# EasyEDA schematic gcgc2.json
TITLE: Sheet_1; REV: 1.0; Date: 2021-07-03; Sheet: 1/1; Company: Your Company
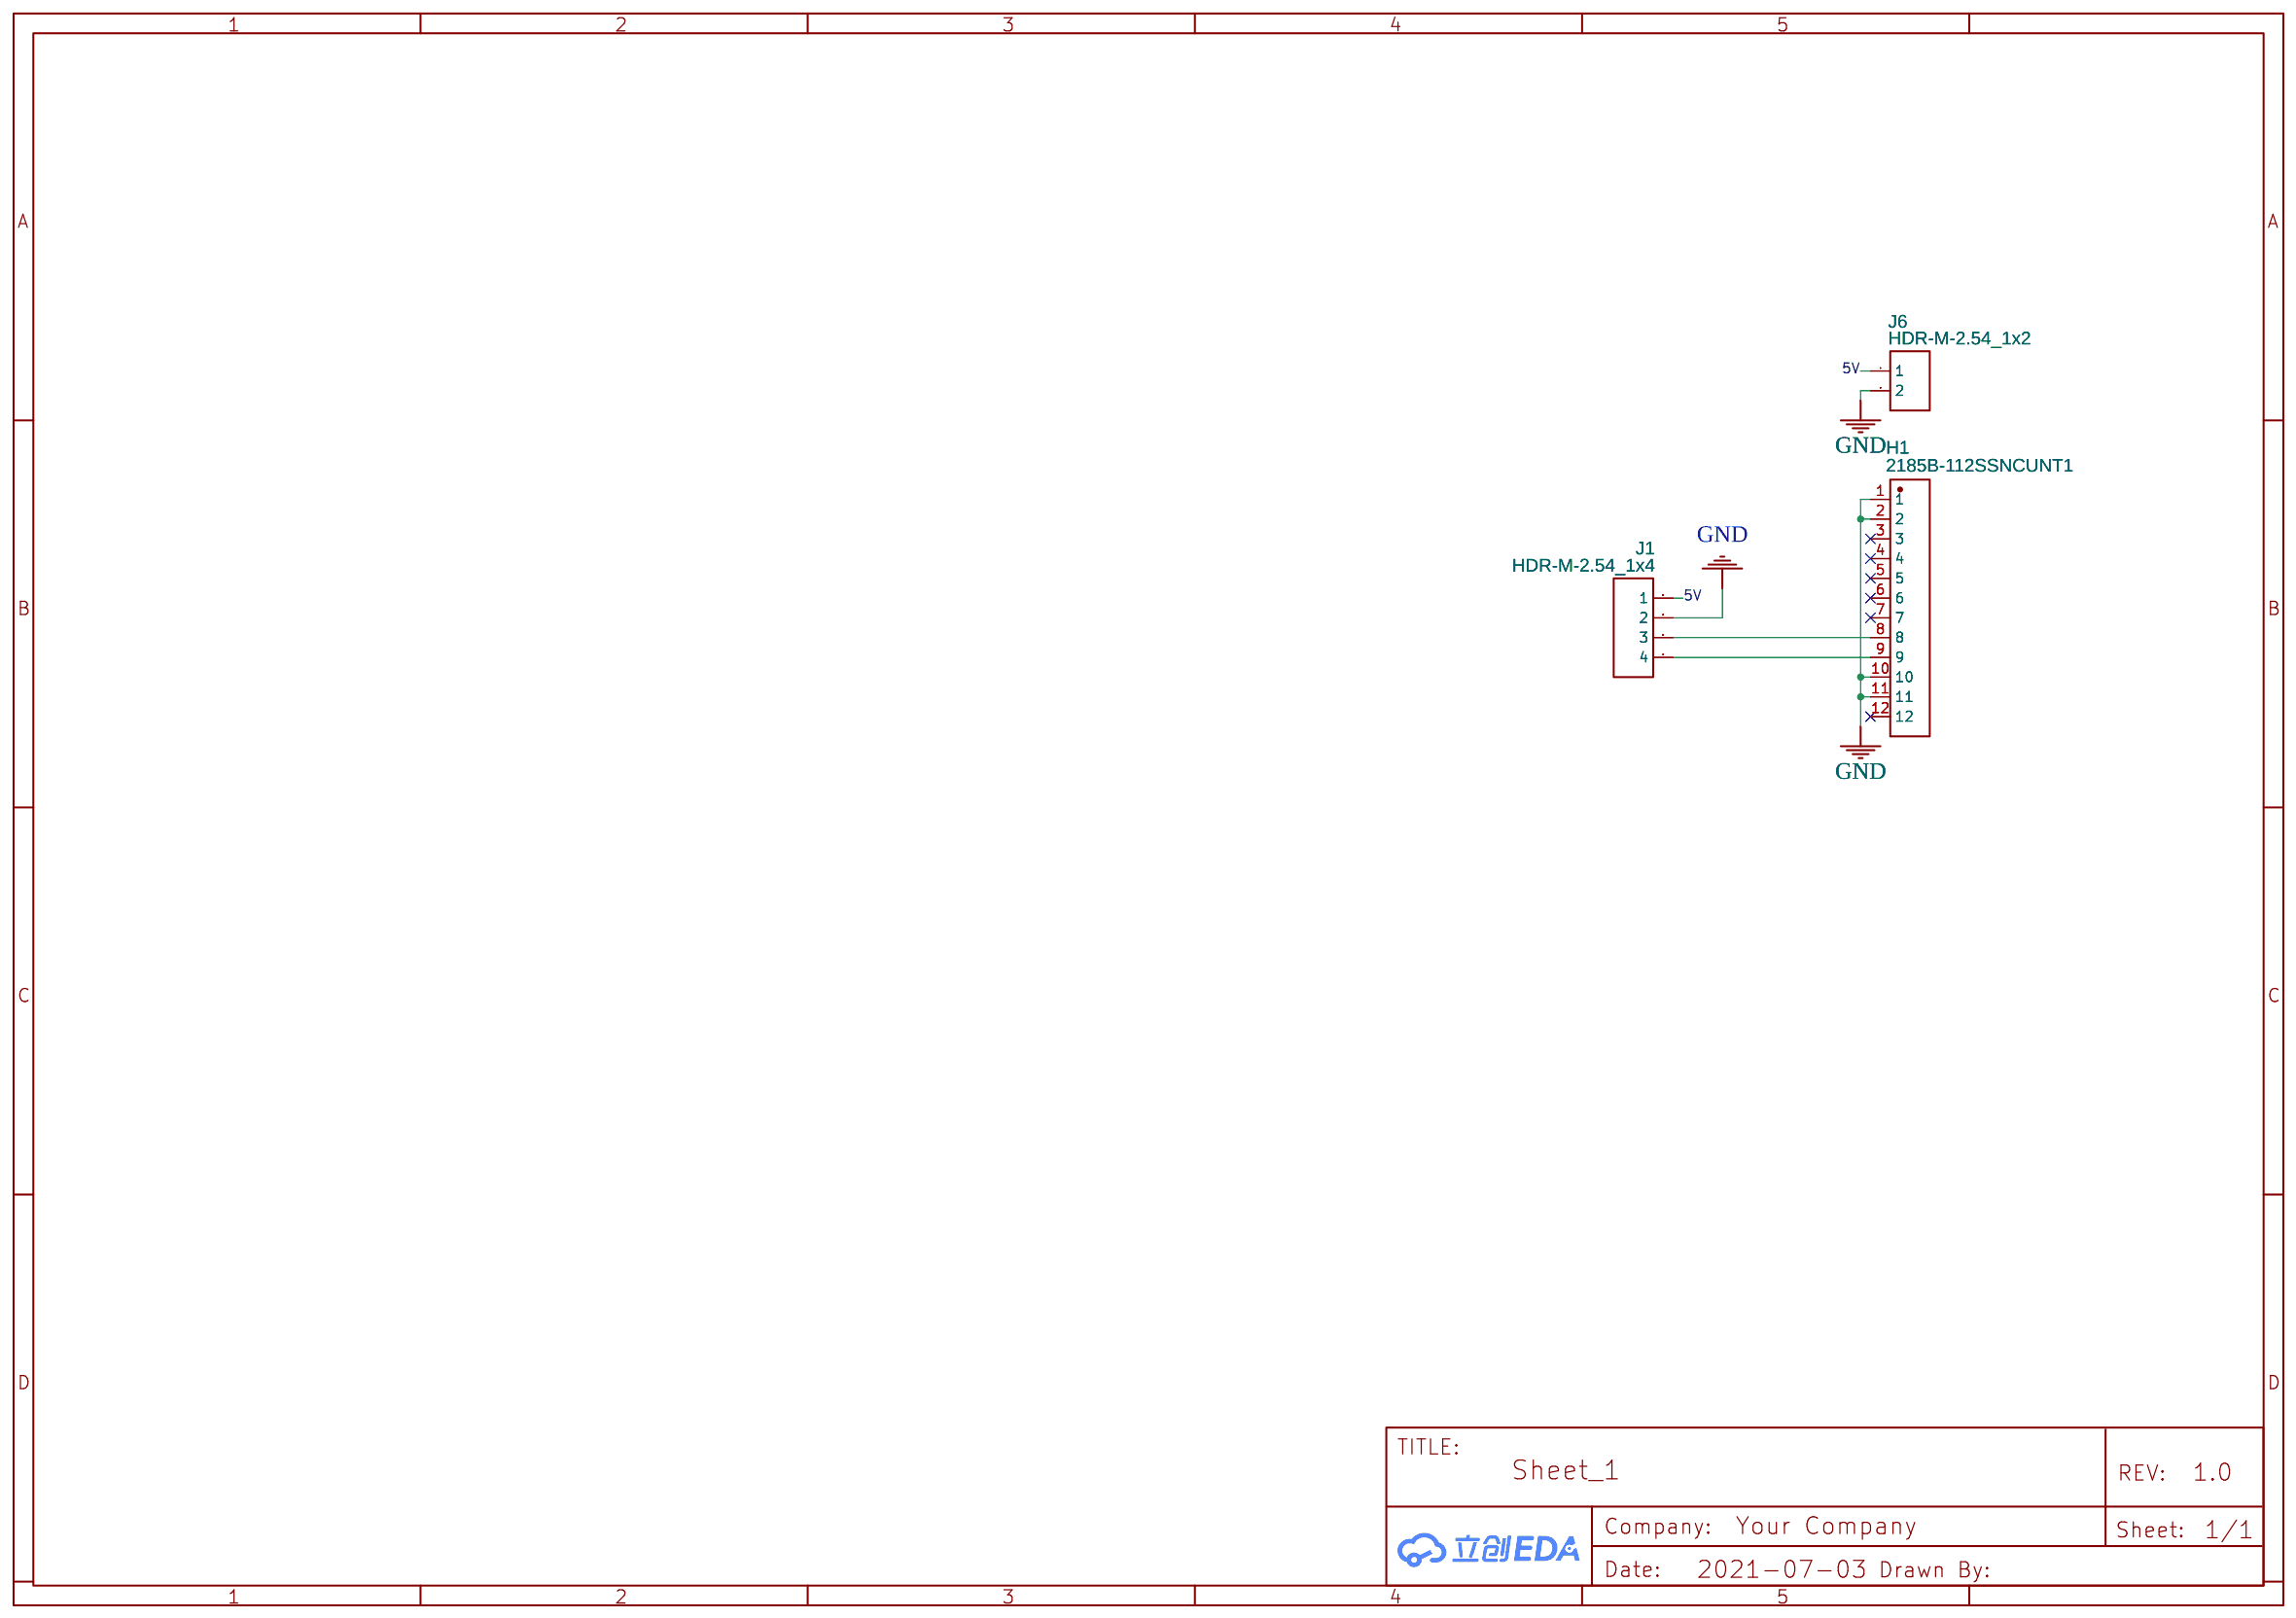
[diagram p0: schematic sheet]

## Parts
H1  2185B-112SSNCUNT1  [HDR-TH_12P-P2.54-V-F]
J1  HDR-M-2.54_1x4  [HDR-M-2.54_1X4]
J6  HDR-M-2.54_1x2  [HDR-M-2.54_1X2]

## Library data of the parts
H1 = 2185B-112SSNCUNT1: Supplier: LCSC; Supplier Part: C721800; Manufacturer: Wcon; Contributor: LCSC; JLCPCB Part Class: Extended Part
J1 = HDR-M-2.54_1x4: Supplier Part: C124378; Supplier: LCSC; Contributor: LCEDA_Lib
J6 = HDR-M-2.54_1x2: Supplier Part: C124375; Supplier: LCSC; Contributor: LCEDA_Lib

## Nets
5V: J1.1 J6.1
GND: H1.1 H1.2 H1.10 H1.11 J1.2 J6.2
Net-(H1-8): H1.8 J1.3
Net-(H1-9): H1.9 J1.4

Not connected (* = marked no-connect by the designer): H1 3* 4* 5* 6* 7* 12*
